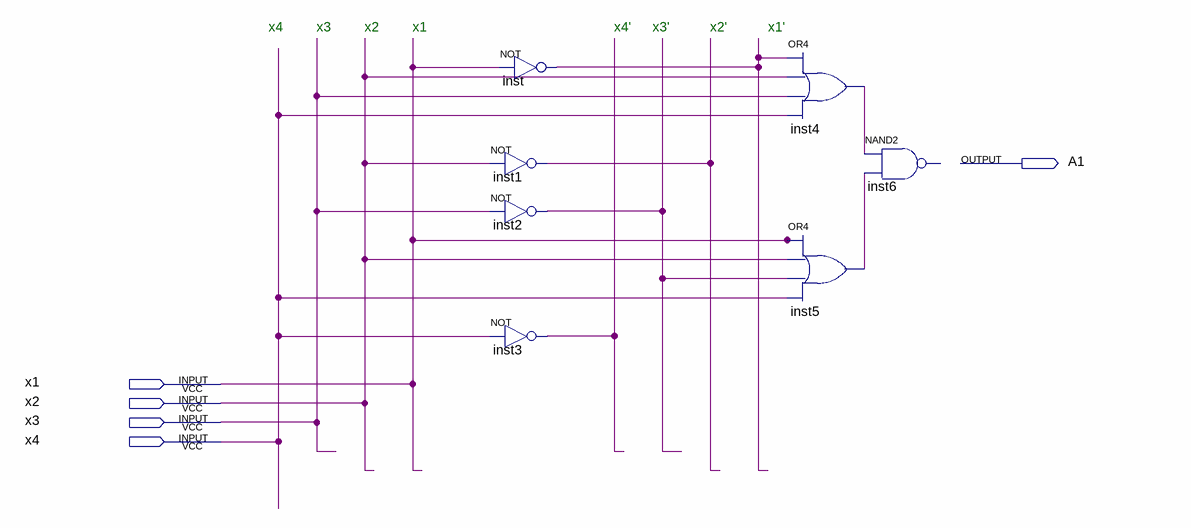
[diagram p0: schematic sheet]
// Quartus schematic indicator1.bdf as structural Verilog: 7 symbols, 5 pins
module indicator1 (
  input  x1,
  input  x2,
  input  x3,
  input  x4,
  output A1
);

  wire inst1_out, inst2_out, inst3_out, inst4_out, inst5_out, inst_out;

  not inst (inst_out, x1);
  not inst1 (inst1_out, x2);
  not inst2 (inst2_out, x3);
  not inst3 (inst3_out, x4);
  or inst4 (inst4_out, inst_out, x2, x3, x4);
  or inst5 (inst5_out, x1, x2, inst2_out, x4);
  // NAND2 inst6 has open pins: IN1=inst4_out, IN2=inst5_out, OUT=open

  // Notes on the sheet:
  //   x4
  //   x3
  //   x2
  //   x1
  //   x4'
  //   x3'
  //   x2'
  //   x1'
endmodule
